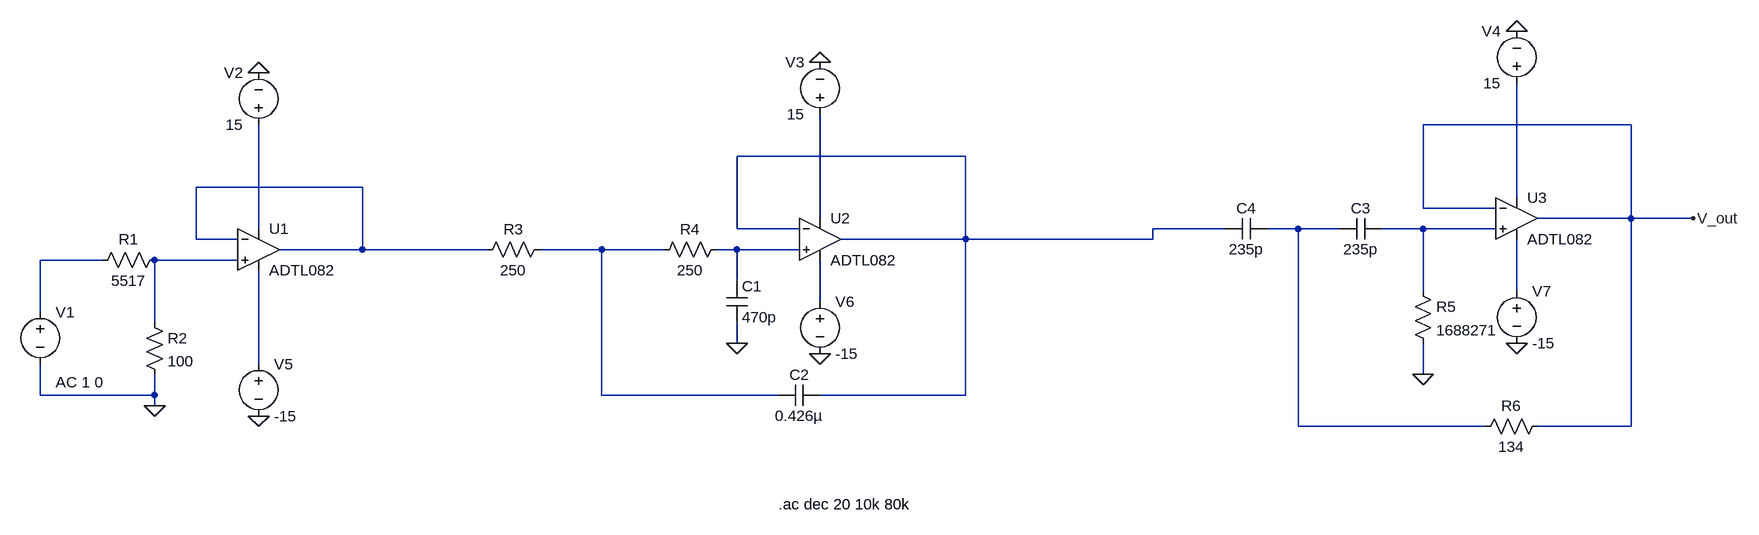
[diagram p0: schematic Passe_bande_Tcheby.asc]
Passe_bande_Tcheby.asc, the LTspice schematic file:
Version 4.1
SHEET 1 2724 680
WIRE 2544 -192 2224 -192
WIRE 1520 -144 1168 -144
WIRE 592 -96 336 -96
WIRE 2368 -80 2368 -256
WIRE 2224 -64 2224 -192
WIRE 2336 -64 2224 -64
WIRE 1296 -48 1296 -208
WIRE 2544 -48 2544 -192
WIRE 2544 -48 2400 -48
WIRE 2640 -48 2544 -48
WIRE 432 -32 432 -192
WIRE 1168 -32 1168 -144
WIRE 1264 -32 1168 -32
WIRE 1920 -32 1808 -32
WIRE 2032 -32 1984 -32
WIRE 2096 -32 2032 -32
WIRE 2224 -32 2160 -32
WIRE 2336 -32 2224 -32
WIRE 336 -16 336 -96
WIRE 400 -16 336 -16
WIRE 1520 -16 1520 -144
WIRE 1520 -16 1328 -16
WIRE 1808 -16 1808 -32
WIRE 1808 -16 1520 -16
WIRE 592 0 592 -96
WIRE 592 0 464 0
WIRE 784 0 592 0
WIRE 960 0 864 0
WIRE 1056 0 960 0
WIRE 1168 0 1136 0
WIRE 1264 0 1168 0
WIRE 192 16 96 16
WIRE 400 16 272 16
WIRE 1168 48 1168 0
WIRE 2224 64 2224 -32
WIRE 2368 64 2368 -16
WIRE 1296 80 1296 16
WIRE 96 96 96 16
WIRE 272 112 272 16
WIRE 1168 144 1168 112
WIRE 432 176 432 32
WIRE 2224 192 2224 144
WIRE 96 224 96 176
WIRE 272 224 272 192
WIRE 272 224 96 224
WIRE 960 224 960 0
WIRE 1232 224 960 224
WIRE 1520 224 1520 -16
WIRE 1520 224 1296 224
WIRE 272 240 272 224
WIRE 2032 272 2032 -32
WIRE 2320 272 2032 272
WIRE 2544 272 2544 -48
WIRE 2544 272 2400 272
FLAG 272 240 0
FLAG 1168 144 0
FLAG 2224 192 0
FLAG 432 -272 0
FLAG 1296 -288 0
FLAG 2368 -336 0
FLAG 432 256 0
FLAG 1296 160 0
FLAG 2368 144 0
FLAG 2640 -48 V_out
SYMBOL voltage 96 80 R0
WINDOW 123 24 124 Left 2
WINDOW 39 0 0 Left 0
SYMATTR InstName V1
SYMATTR Value ""
SYMATTR Value2 AC 1 0
SYMBOL res 288 0 R90
WINDOW 0 0 56 VBottom 2
WINDOW 3 32 56 VTop 2
SYMATTR InstName R1
SYMATTR Value 5517
SYMBOL res 256 96 R0
SYMATTR InstName R2
SYMATTR Value 100
SYMBOL OpAmps\\ADTL082 432 -64 R0
SYMATTR InstName U1
SYMBOL res 880 -16 R90
WINDOW 0 0 56 VBottom 2
WINDOW 3 32 56 VTop 2
SYMATTR InstName R3
SYMATTR Value 250
SYMBOL OpAmps\\ADTL082 1296 -80 R0
SYMATTR InstName U2
SYMBOL cap 1152 48 R0
SYMATTR InstName C1
SYMATTR Value 470p
SYMBOL res 1152 -16 R90
WINDOW 0 0 56 VBottom 2
WINDOW 3 32 56 VTop 2
SYMATTR InstName R4
SYMATTR Value 250
SYMBOL cap 1296 208 R90
WINDOW 0 0 32 VBottom 2
WINDOW 3 32 32 VTop 2
SYMATTR InstName C2
SYMATTR Value 0.426µ
SYMBOL OpAmps\\ADTL082 2368 -112 R0
SYMATTR InstName U3
SYMBOL res 2208 48 R0
SYMATTR InstName R5
SYMATTR Value 1688271
SYMBOL cap 2160 -48 R90
WINDOW 0 0 32 VBottom 2
WINDOW 3 32 32 VTop 2
SYMATTR InstName C3
SYMATTR Value 235p
SYMBOL cap 1984 -48 R90
WINDOW 0 0 32 VBottom 2
WINDOW 3 32 32 VTop 2
SYMATTR InstName C4
SYMATTR Value 235p
SYMBOL res 2416 256 R90
WINDOW 0 0 56 VBottom 2
WINDOW 3 32 56 VTop 2
SYMATTR InstName R6
SYMATTR Value 134
SYMBOL voltage 432 -176 R180
WINDOW 0 24 96 Left 2
WINDOW 3 24 16 Left 2
SYMATTR InstName V2
SYMATTR Value 15
SYMBOL voltage 1296 -192 R180
WINDOW 0 24 96 Left 2
WINDOW 3 24 16 Left 2
SYMATTR InstName V3
SYMATTR Value 15
SYMBOL voltage 2368 -240 R180
WINDOW 0 24 96 Left 2
WINDOW 3 24 16 Left 2
SYMATTR InstName V4
SYMATTR Value 15
SYMBOL voltage 432 160 R0
SYMATTR InstName V5
SYMATTR Value -15
SYMBOL voltage 1296 64 R0
SYMATTR InstName V6
SYMATTR Value -15
SYMBOL voltage 2368 48 R0
SYMATTR InstName V7
SYMATTR Value -15
TEXT 1232 392 Left 2 !.ac dec 20 10k 80k

The netlist it stands for:
* Passe_bande_Tcheby.asc
V1 N010 0 AC 1 0
R1 N011 N010 5517
R2 N011 0 100
X§U1 N011 N002 N005 N014 N002 ADTL082  ; pins In+ In- V+ V- OUT
R3 N008 N002 250
X§U2 N009 N001 N004 N013 N001 ADTL082  ; pins In+ In- V+ V- OUT
C1 N009 0 470p
R4 N009 N008 250
C2 N001 N008 0.426µ
X§U3 N007 V_out N003 N012 V_out ADTL082  ; pins In+ In- V+ V- OUT
R5 N007 0 1688271
C3 N007 N006 235p
C4 N006 N001 235p
R6 V_out N006 134
V2 N005 0 15
V3 N004 0 15
V4 N003 0 15
V5 N014 0 -15
V6 N013 0 -15
V7 N012 0 -15
.ac dec 20 10k 80k
.lib ADI.lib
.backanno
.end